# EAGLE schematic nucleo-block3-a-5 (EAGLE 9.6.2)
AUTHOR: Balazs Racz; DRAWING_TITLE: FREMO 3x Blockplatine; LICENSE: Licensed by the Solderpad Hardware License V2.0; REVIEWER: n/a; REVISION: A1; YEAR: 2024
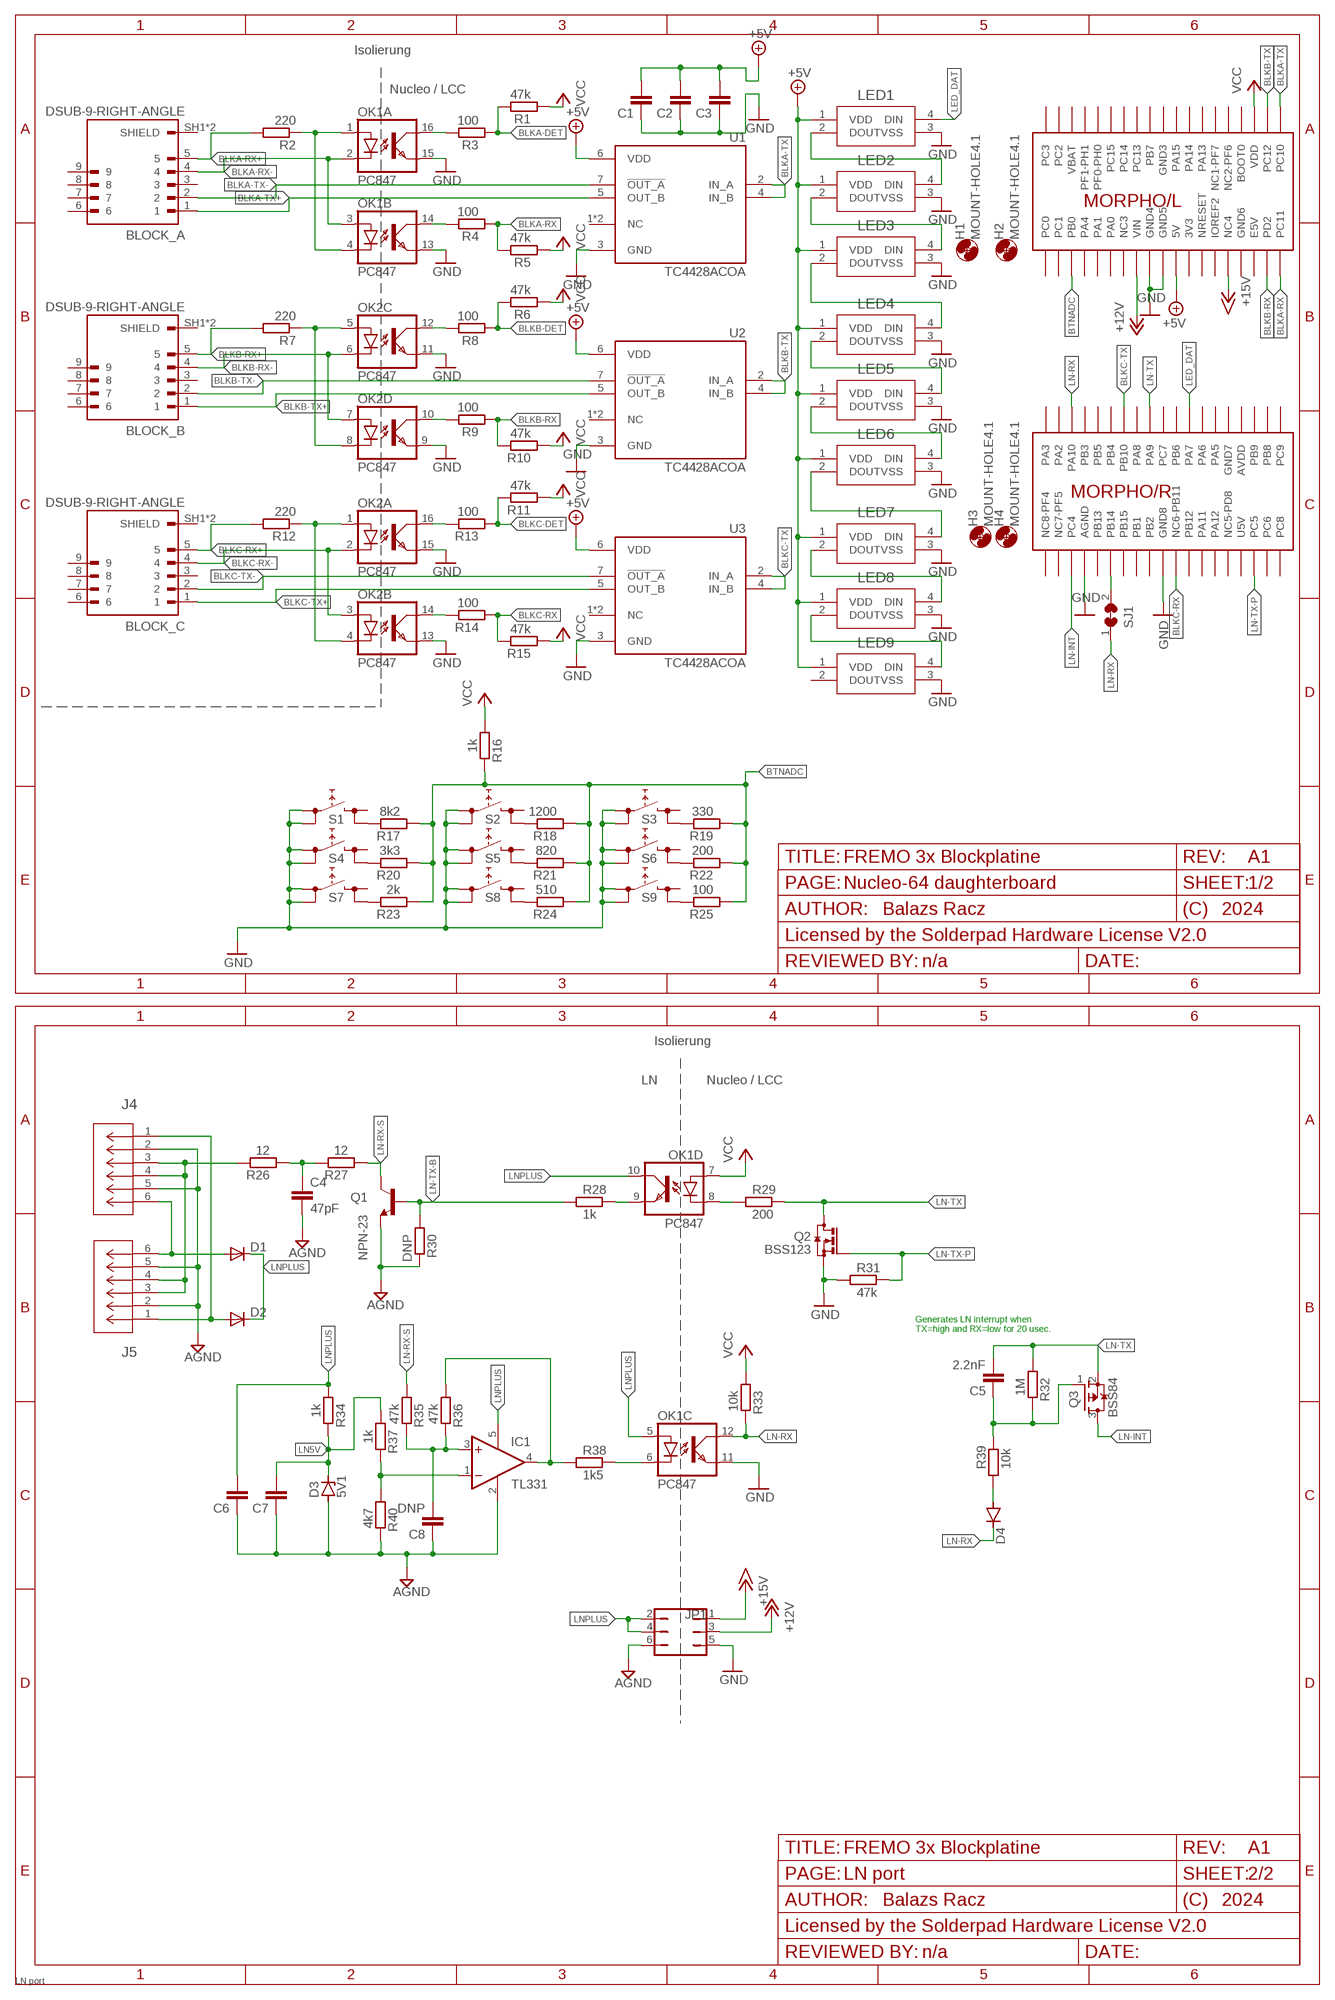
[diagram p0: schematic, sheet 1]
FRAME1 (FRAME_A_L): PAGE: Nucleo-64 daughterboard
FRAME2 (FRAME_A_L): PAGE: Input ports
FRAME3 (FRAME_A_L): PAGE: LN port

## Parts
BLOCK_A  DSUB-9-RIGHT-ANGLE  [ASSMANN_A-DS_09_A_KG-T2S]
BLOCK_B  DSUB-9-RIGHT-ANGLE  [ASSMANN_A-DS_09_A_KG-T2S]
BLOCK_C  DSUB-9-RIGHT-ANGLE  [ASSMANN_A-DS_09_A_KG-T2S]
C1  C-EUC0805  [C0805]
C2  C-EUC0805  [C0805]
C3  C-EUC0805  [C0805]
C4  47pF  C-EUC0805  [C0805]
C5  2.2nF  C-EUC0805  [C0805]
C6  C-EUC0805  [C0805]
C7  C-EUC0805  [C0805]
C8  DNP  C-EUC0805  [C0805]
D1  DIODEDO-214AA-NODOC  [DO214AA-NODOC]
D2  DIODEDO-214AA-NODOC  [DO214AA-NODOC]
D3  5V1  ZENER-DIODESOD80C  [SOD80C]
D4  DIODE-MINIMELF  [MINIMELF]
G1  NUCLEO_64_GENERIC  [NUCLEO_BRD_BASE64]
H1  MOUNT-HOLE4.1  [4,1]
H2  MOUNT-HOLE4.1  [4,1]
H3  MOUNT-HOLE4.1  [4,1]
H4  MOUNT-HOLE4.1  [4,1]
IC1  TL331  [DBV-R-PDSO-G5]
J4  MODJACK6P6C-MJ3245-66-0CONN_MJ3245-66-0_GCT  [CONN_MJ3245-66-0_GCT]
J5  MODJACK6P6C-MJ3245-66-0CONN_MJ3245-66-0_GCT  [CONN_MJ3245-66-0_GCT]
JP1  JP3Q  [JP3Q]
LED1  LED-2812BCOM-16347_SPK-M  [COM-16347_SPK-M]
LED2  LED-2812BCOM-16347_SPK-M  [COM-16347_SPK-M]
LED3  LED-2812BCOM-16347_SPK-M  [COM-16347_SPK-M]
LED4  LED-2812BCOM-16347_SPK-M  [COM-16347_SPK-M]
LED5  LED-2812BCOM-16347_SPK-M  [COM-16347_SPK-M]
LED6  LED-2812BCOM-16347_SPK-M  [COM-16347_SPK-M]
LED7  LED-2812BCOM-16347_SPK-M  [COM-16347_SPK-M]
LED8  LED-2812BCOM-16347_SPK-M  [COM-16347_SPK-M]
LED9  LED-2812BCOM-16347_SPK-M  [COM-16347_SPK-M]
OK1  PC847  [DIL16]
OK2  PC847  [DIL16]
Q1  NPN-23  [SOT23]
Q2  BSS123  [SOT23-NCH]
Q3  BSS84  [SOT23-PCH]
R1  47k  R-EU_R0805  [R0805]
R2  220  R-EU_R0805  [R0805]
R3  100  R-EU_R0805  [R0805]
R4  100  R-EU_R0805  [R0805]
R5  47k  R-EU_R0805  [R0805]
R6  47k  R-EU_R0805  [R0805]
R7  220  R-EU_R0805  [R0805]
R8  100  R-EU_R0805  [R0805]
R9  100  R-EU_R0805  [R0805]
R10  47k  R-EU_R0805  [R0805]
R11  47k  R-EU_R0805  [R0805]
R12  220  R-EU_R0805  [R0805]
R13  100  R-EU_R0805  [R0805]
R14  100  R-EU_R0805  [R0805]
R15  47k  R-EU_R0805  [R0805]
R16  1k  R-EU_R0805  [R0805]
R17  8k2  R-EU_R0603  [R0603]
R18  1200  R-EU_R0603  [R0603]
R19  330  R-EU_R0603  [R0603]
R20  3k3  R-EU_R0603  [R0603]
R21  820  R-EU_R0603  [R0603]
R22  200  R-EU_R0603  [R0603]
R23  2k  R-EU_R0603  [R0603]
R24  510  R-EU_R0603  [R0603]
R25  100  R-EU_R0603  [R0603]
R26  12  R-EU_R0805  [R0805]
R27  12  R-EU_R0805  [R0805]
R28  1k  R-EU_R0805  [R0805]
R29  200  R-EU_R0805  [R0805]
R30  DNP  R-EU_R0805  [R0805]
R31  47k  R-EU_R0805  [R0805]
R32  1M  R-EU_R0805  [R0805]
R33  10k  R-EU_R0805  [R0805]
R34  1k  R-EU_R0805  [R0805]
R35  47k  R-EU_R0805  [R0805]
R36  47k  R-EU_R0805  [R0805]
R37  1k  R-EU_R0805  [R0805]
R38  1k5  R-EU_R0805  [R0805]
R39  10k  R-EU_R0805  [R0805]
R40  4k7  R-EU_R0805  [R0805]
S1  W1  TACTSW-6X6S  [TACTSW-6X6]
S2  W1  TACTSW-6X6S  [TACTSW-6X6]
S3  W1  TACTSW-6X6S  [TACTSW-6X6]
S4  W1  TACTSW-6X6S  [TACTSW-6X6]
S5  W1  TACTSW-6X6S  [TACTSW-6X6]
S6  W1  TACTSW-6X6S  [TACTSW-6X6]
S7  W1  TACTSW-6X6S  [TACTSW-6X6]
S8  W1  TACTSW-6X6S  [TACTSW-6X6]
S9  W1  TACTSW-6X6S  [TACTSW-6X6]
SJ1  SJ-C  [SJW-C]
U1  TC4428ACOA  [SOIC127P600X175-8N]
U2  TC4428ACOA  [SOIC127P600X175-8N]
U3  TC4428ACOA  [SOIC127P600X175-8N]

## Nets
+5V: C1.2 C2.2 C3.2 G1.5V2(5V) LED1.1(VDD) LED2.1(VDD) LED3.1(VDD) LED4.1(VDD) LED5.1(VDD) LED6.1(VDD) LED7.1(VDD) LED8.1(VDD) LED9.1(VDD) U1.6(VDD) U2.6(VDD) U3.6(VDD)
+12V: G1.VIN2(VIN) JP1.3
+15V: G1.NC4 JP1.1
AGND: C4.2 C6.1 C7.1 C8.1 D3.A IC1.2(GND) J4.2 J4.5 J5.2 J5.5 JP1.6 Q1.2(E) R30.2 R40.2
BLKA-DET: R1.2 R3.1
BLKA-RX: G1.PC11 R4.1 R5.2
BLKA-RX+: BLOCK_A.5 R2.2
BLKA-RX-: BLOCK_A.4 OK1.2(A:C) OK1.3(B:A)
BLKA-TX: G1.PC10 U1.2(IN_A) U1.4(IN_B)
BLKA-TX+: BLOCK_A.1 U1.5(OUT_B)
BLKA-TX-: BLOCK_A.2 U1.7(!OUT_A)
BLKB-DET: R6.2 R8.1
BLKB-RX: G1.PD2 R9.1 R10.2
BLKB-RX+: BLOCK_B.5 R7.2
BLKB-RX-: BLOCK_B.4 OK2.6(C:C) OK2.7(D:A)
BLKB-TX: G1.PC12 U2.2(IN_A) U2.4(IN_B)
BLKB-TX+: BLOCK_B.1 U2.5(OUT_B)
BLKB-TX-: BLOCK_B.2 U2.7(!OUT_A)
BLKC-DET: R11.2 R13.1
BLKC-RX: G1.NC6-PB11 R14.1 R15.2
BLKC-RX+: BLOCK_C.5 R12.2
BLKC-RX-: BLOCK_C.4 OK2.2(A:C) OK2.3(B:A)
BLKC-TX: G1.PB10 U3.2(IN_A) U3.4(IN_B)
BLKC-TX+: BLOCK_C.1 U3.5(OUT_B)
BLKC-TX-: BLOCK_C.2 U3.7(!OUT_A)
BTNADC: G1.PB0 R16.2 R17.1 R18.1 R19.1 R20.1 R21.1 R22.1 R23.1 R24.1 R25.1
GND: C1.1 C2.1 C3.1 G1.AGND G1.GND4 G1.GND5 G1.GND8 JP1.5 LED1.3(VSS) LED2.3(VSS) LED3.3(VSS) LED4.3(VSS) LED5.3(VSS) LED6.3(VSS) LED7.3(VSS) LED8.3(VSS) LED9.3(VSS) OK1.11(C:EMIT) OK1.13(B:EMIT) OK1.15(A:EMIT) OK2.9(D:EMIT) OK2.11(C:EMIT) OK2.13(B:EMIT) OK2.15(A:EMIT) Q2.2(S) R31.1 S1.1(1.1) S1.2(1.2) S2.1(1.1) S2.2(1.2) S3.1(1.1) S3.2(1.2) S4.1(1.1) S4.2(1.2) S5.1(1.1) S5.2(1.2) S6.1(1.1) S6.2(1.2) S7.1(1.1) S7.2(1.2) S8.1(1.1) S8.2(1.2) S9.1(1.1) S9.2(1.2) U1.3(GND) U2.3(GND) U3.3(GND)
LED_DAT: G1.PA7 LED1.4(DIN)
LN5V: C7.2 D3.C R34.2 R37.1
LN-INT: G1.PC4 Q3.3(D)
LN-RX: D4.C G1.PA10 OK1.12(C:COL) R33.2 SJ1.1
LN-RX-S: Q1.3(C) R27.1 R35.1
LN-TX: C5.2 G1.PA9 Q2.3(D) Q3.2(S) R29.2 R32.1
LN-TX-B: Q1.1(B) R28.1 R30.1
LN-TX-P: G1.PC5 Q2.1(G) R31.2
LNPLUS: C6.2 D1.C D2.C IC1.5(V+) JP1.2 JP1.4 OK1.5(C:A) OK1.10(D:COL) R34.1
N$1: OK2.1(A:A) OK2.4(B:C) R12.1
N$2: OK2.16(A:COL) R13.2
N$3: OK2.14(B:COL) R14.2
N$4: D1.A J4.6 J5.6
N$5: C4.1 R26.1 R27.2
N$6: D2.A J4.1 J5.1
N$7: J4.3 J4.4 J5.3 J5.4 R26.2
N$9: R17.2 S1.4(2.2)
N$10: D4.A R39.1
N$11: OK1.9(D:EMIT) R28.2
N$12: LED1.2(DOUT) LED2.4(DIN)
N$13: LED2.2(DOUT) LED3.4(DIN)
N$14: LED3.2(DOUT) LED4.4(DIN)
N$15: LED4.2(DOUT) LED5.4(DIN)
N$16: LED5.2(DOUT) LED6.4(DIN)
N$17: LED6.2(DOUT) LED7.4(DIN)
N$18: LED7.2(DOUT) LED8.4(DIN)
N$19: LED8.2(DOUT) LED9.4(DIN)
N$20: G1.PB14 SJ1.2
N$21: R20.2 S4.4(2.2)
N$22: C5.1 Q3.1(G) R32.2 R39.2
N$23: R23.2 S7.4(2.2)
N$26: R18.2 S2.4(2.2)
N$27: R21.2 S5.4(2.2)
N$28: R24.2 S8.4(2.2)
N$29: IC1.1(-IN) R37.2 R40.1
N$30: C8.2 IC1.3(+IN) R35.2 R36.2
N$31: OK1.1(A:A) OK1.4(B:C) R2.1
N$32: R19.2 S3.4(2.2)
N$33: R22.2 S6.4(2.2)
N$34: R25.2 S9.4(2.2)
N$35: OK2.5(C:A) OK2.8(D:C) R7.1
N$36: IC1.4(OUT) R36.1 R38.1
N$38: OK1.8(D:C) R29.1
N$39: OK1.6(C:C) R38.2
N$41: OK1.16(A:COL) R3.2
N$42: OK1.14(B:COL) R4.2
N$43: OK2.12(C:COL) R8.2
N$44: OK2.10(D:COL) R9.2
VCC: G1.VDD OK1.7(D:A) R1.1 R5.1 R6.1 R10.1 R11.1 R15.1 R16.1 R33.1
Unconnected: BLOCK_A.3 BLOCK_A.6 BLOCK_A.7 BLOCK_A.8 BLOCK_A.9 BLOCK_A.SH1(SHIELD) BLOCK_A.SH2(SHIELD) BLOCK_B.3 BLOCK_B.6 BLOCK_B.7 BLOCK_B.8 BLOCK_B.9 BLOCK_B.SH1(SHIELD) BLOCK_B.SH2(SHIELD) BLOCK_C.3 BLOCK_C.6 BLOCK_C.7 BLOCK_C.8 BLOCK_C.9 BLOCK_C.SH1(SHIELD) BLOCK_C.SH2(SHIELD) G1.BOOT0 G1.IOREF2 G1.NC1-PF7 G1.NC2-PF6 G1.NC3 G1.NC5-PD8 G1.NC7-PF5 G1.NC8-PF4 G1.NRESET G1.PA0 G1.PA1 G1.PA2 G1.PA3 G1.PA4 G1.PA5 G1.PA6 G1.PA8 G1.PA11 G1.PA12 G1.PA13 G1.PA14 G1.PA15 G1.PB1 G1.PB2 G1.PB3 G1.PB4 G1.PB5 G1.PB6 G1.PB7 G1.PB8 G1.PB9 G1.PB12 G1.PB13 G1.PB15 G1.PC0 G1.PC1 G1.PC2 G1.PC3 G1.PC6 G1.PC7 G1.PC8 G1.PC9 G1.PC13 G1.PC14 G1.PC15 G1.PF0-PH0 G1.PF1-PH1 LED9.2(DOUT) S1.3(2.1) S2.3(2.1) S3.3(2.1) S4.3(2.1) S5.3(2.1) S6.3(2.1) S7.3(2.1) S8.3(2.1) S9.3(2.1) U1.1(NC) U1.8(NC) U2.1(NC) U2.8(NC) U3.1(NC) U3.8(NC)

## Notes on the sheet
- Isolierung
- Nucleo / LCC
- Isolierung
- LN | Nucleo / LCC
- Generates LN interrupt when
  TX=high and RX=low for 20 usec.

## Power pins joined to a net without a drawn wire
3V3: G1.3V3
AVDD: G1.AVDD
E5V: G1.E5V
GND3: G1.GND3
GND6: G1.GND6
GND7: G1.GND7
U5V: G1.U5V
VBAT: G1.VBAT

## Library data of the parts
BLOCK_A BLOCK_B BLOCK_C = eagleparts:DSUB-9-RIGHT-ANGLE: A-DS_09_A_KG-T2S Female: digikey AE10921-ND Male: digikey AE10968-ND; MANUFACTURER: Assmann WSW Components; MAXIMUM_PACKAGE_HEIGHT: 12.8mm; PARTREV: 10; STANDARD: Manufacturer recommendations
C1-C8 = rcl:C-EU: CAPACITOR, European symbol; SPICEPREFIX: C
D1 D2 = trainlib:DIODE
D3 = diode:ZENER-DIODE: Z-Diode
D4 = diode:DIODE-: DIODE
G1 = eagleparts:NUCLEO_64_GENERIC
H1-H4 = holes:MOUNT-HOLE: MOUNTING HOLE with drill center marker
IC1 = linear:TL331: SINGLE DIFFERENTIAL COMPARATOR Source: Data sheet <http://www.ti.com/lit/ds/symlink/tl331-q1.pdf>
J4 J5 = eagleparts:MODJACK6P6C-MJ3245-66-0: 6p6c modular jack digikey: 2073-MJ3245-66-0-ND; COPYRIGHT: Copyright (C) 2024 Ultra Librarian. All rights reserved.; MANUFACTURER_PART_NUMBER: MJ3245-66-0; MFR_NAME: Global Connector Technology; TYPE: Modular Connector Jacks
JP1 = jumper:JP3Q: JUMPER
LED1-LED9 = eagleparts:LED-2812B; COPYRIGHT: Copyright (C) 2024 Ultra Librarian. All rights reserved.; MANUFACTURER_PART_NUMBER: COM-16347; MFR_NAME: Sparkfun; TYPE: LED Addressable
OK1 OK2 = optocoupler:PC847: SHARP OPTO COUPLER; OC_FARNELL: 9707735; OC_NEWARK: unknown
Q1 = eagleparts:NPN-23
Q2 = eagleparts:BSS123: N-CHANNEL MOS FET
Q3 = eagleparts:BSS84: P-CHANNEL MOS FET
R1-R40 = rcl:R-EU_: RESISTOR, European symbol; SPICEPREFIX: R
S1-S9 = g-e2e-training:TACTSW-6X6: 6.2 X 6.5mm TACT Switch (SMD) Source: http://www3.alps.co.jp/WebObjects/catalog.woa/PDF/E/Switch/Tact/SKHM/SKHM.PDF
SJ1 = eagleparts:SJ-C
U1-U3 = eagleparts:TC4428ACOA: Low-Side Gate Driver IC Inverting, Non-Inverting 8-SOIC; MANUFACTURER: Microchip; MAXIMUM_PACKAGE_HEIGHT: 1.75 mm; PARTREV: J; STANDARD: IPC 7351B

## Net classes
0 default: width 0.254 mm, clearance 0.203 mm